# Altium schematic sheet C-02 LvDDR3.SchDoc
size 513 x 386 mm
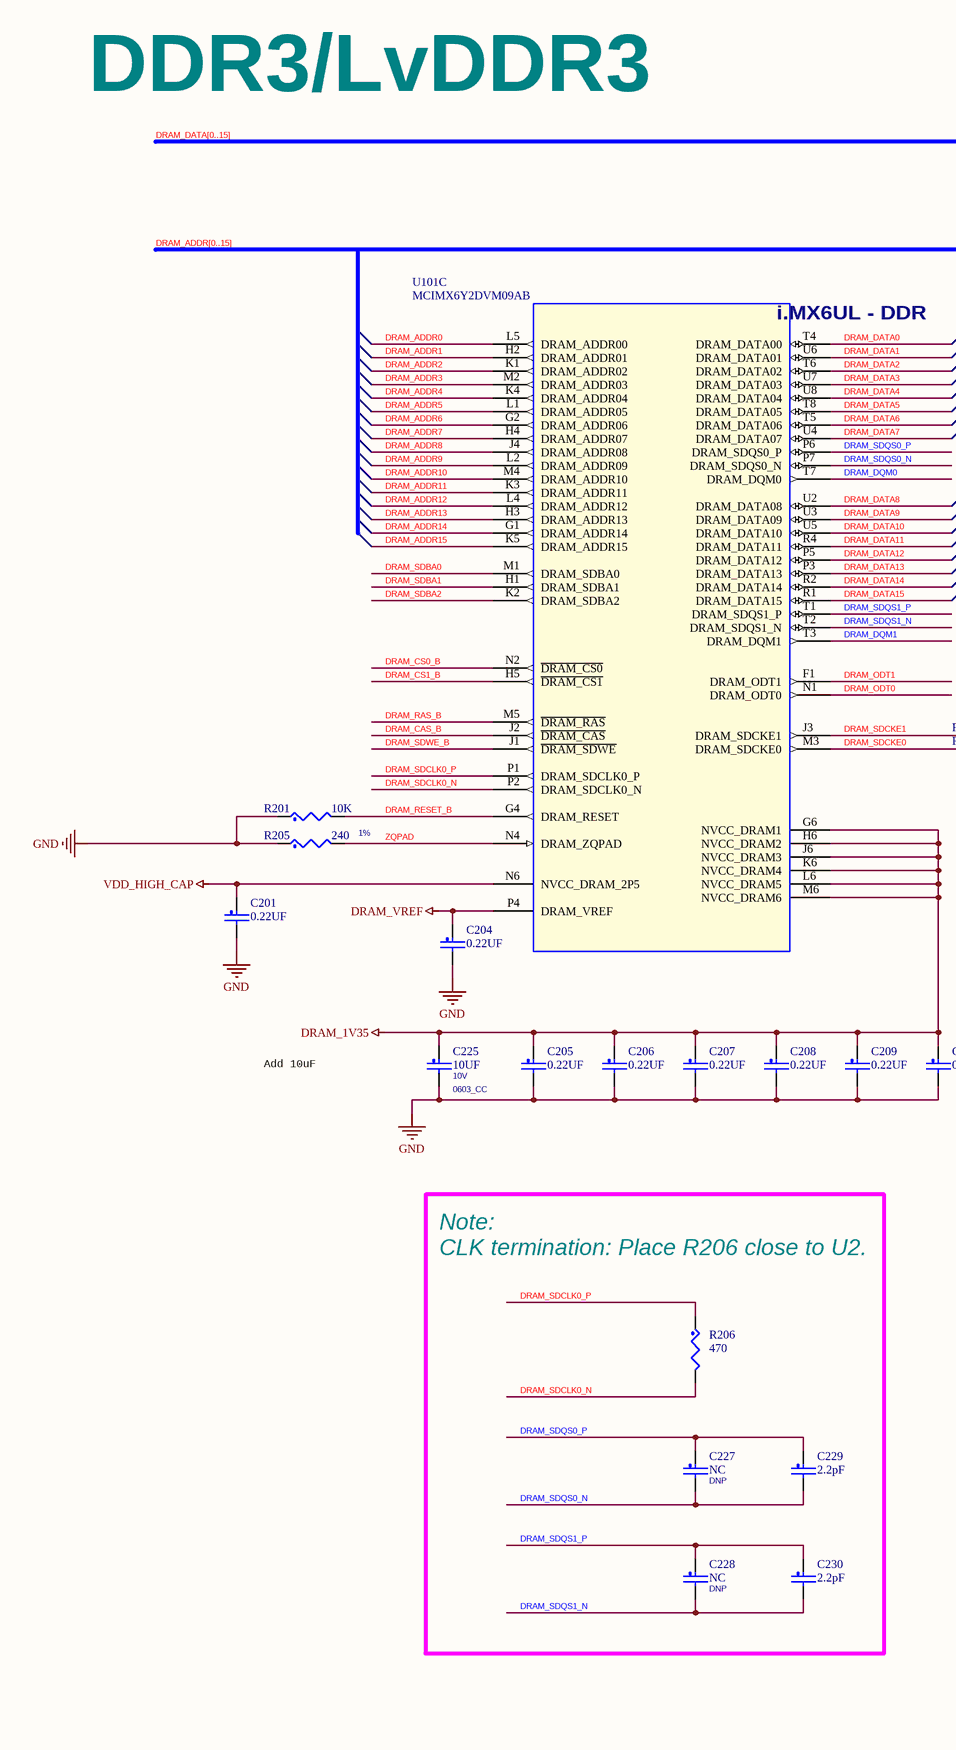
[diagram p0: C-02 LvDDR3.SchDoc, left]
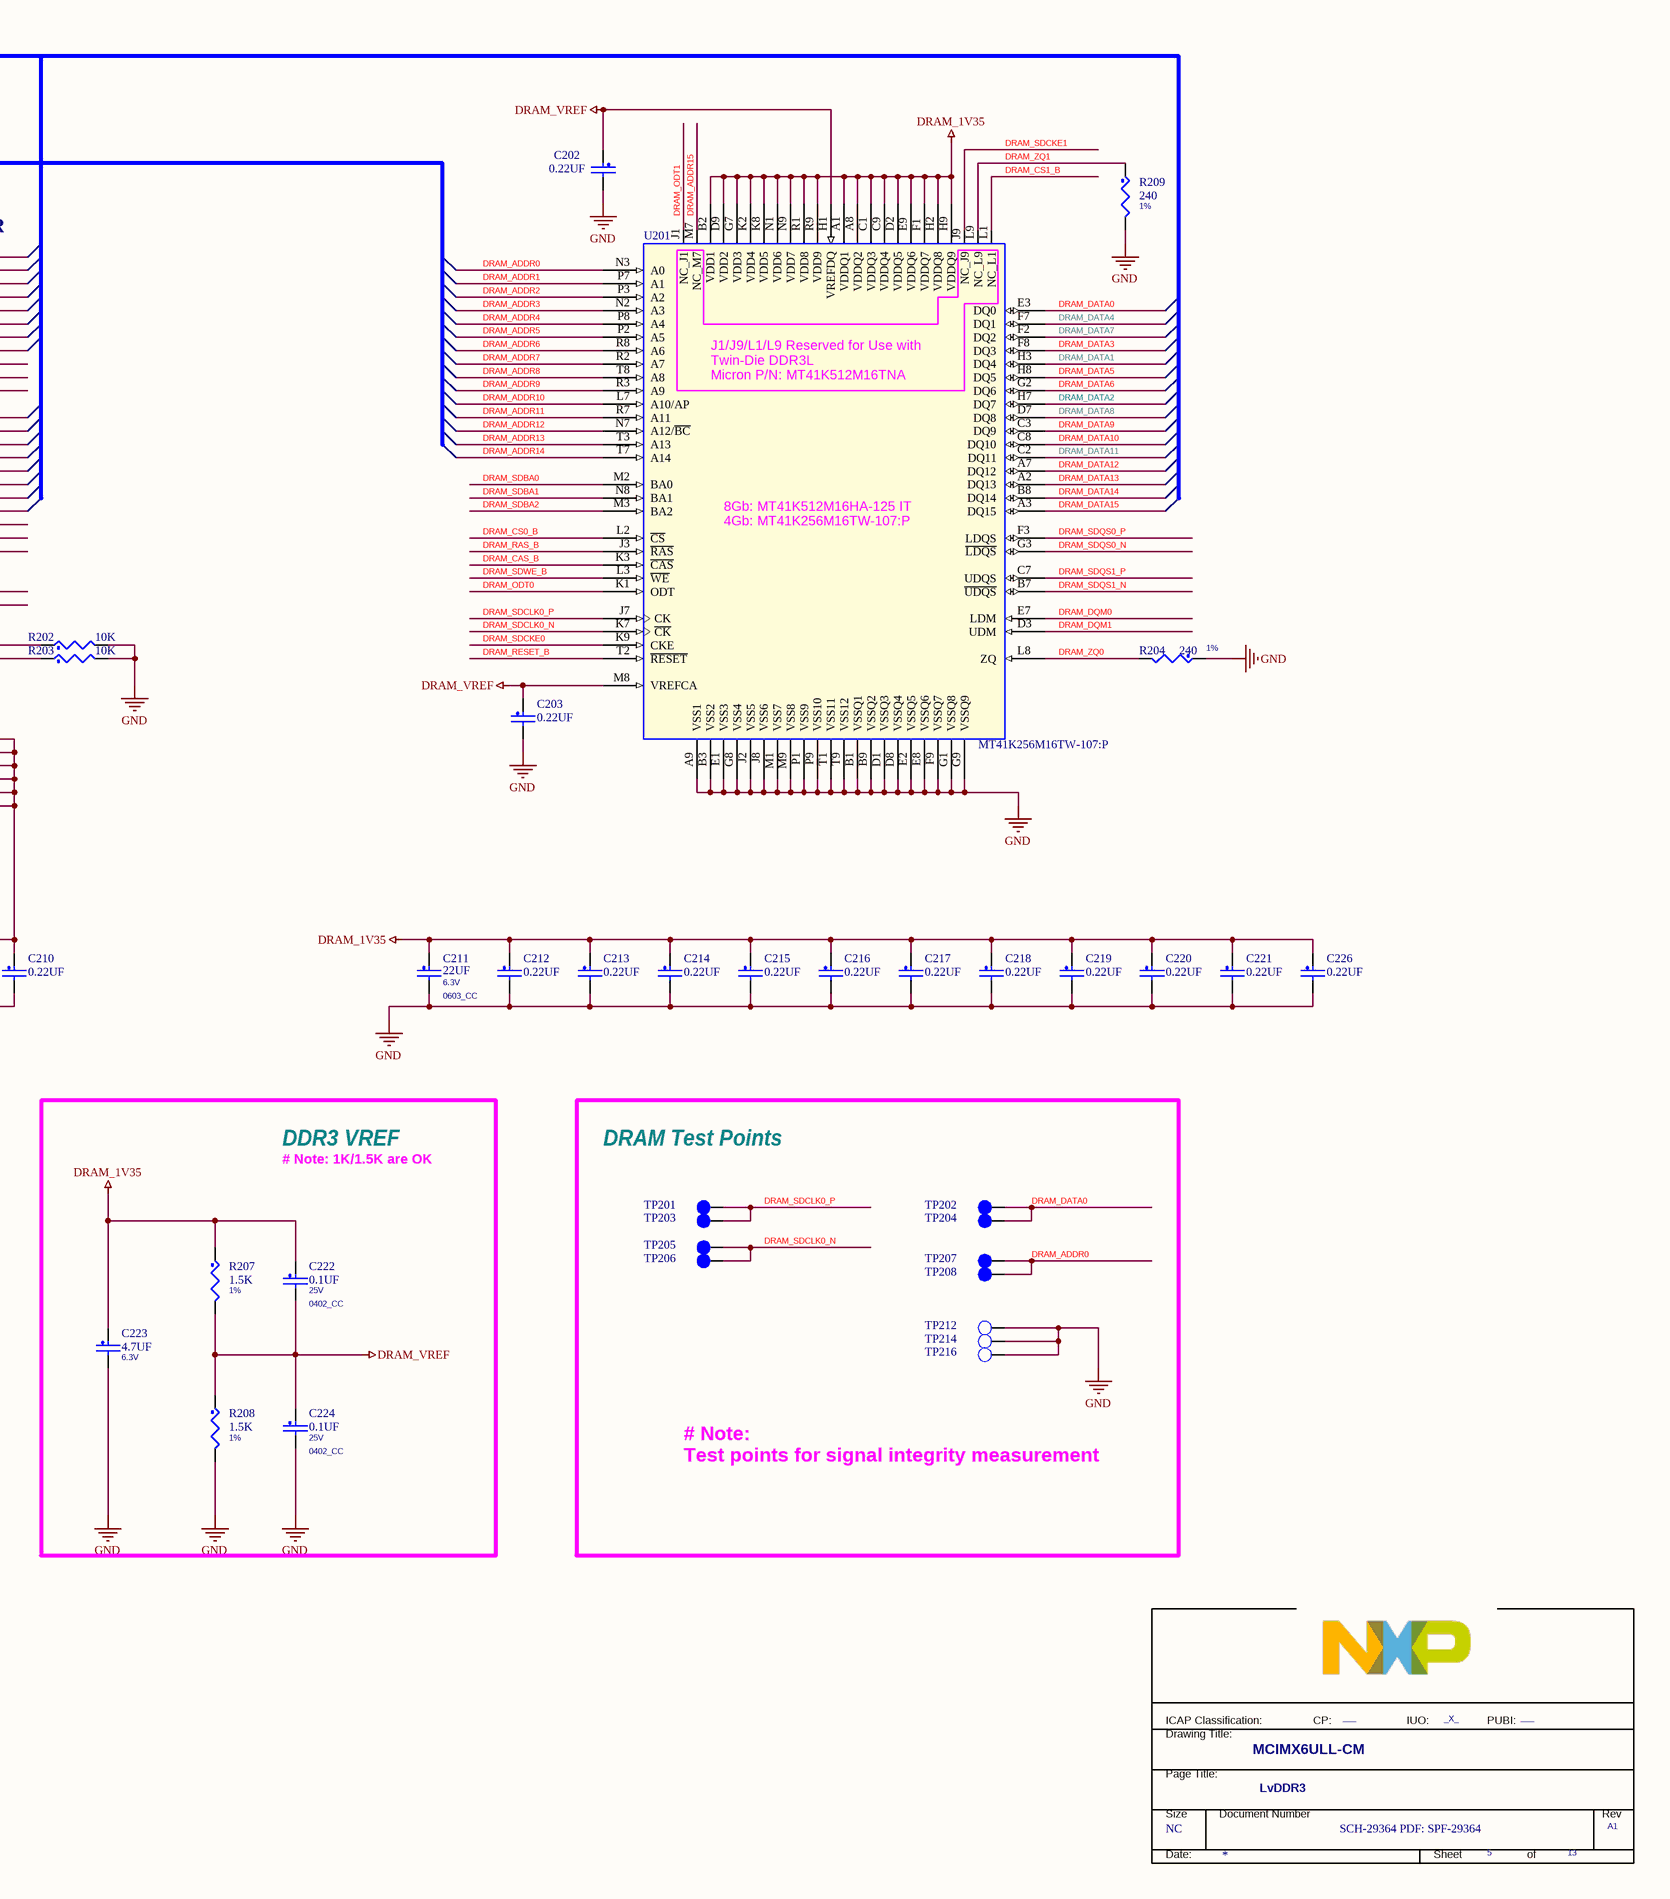
[diagram p1: C-02 LvDDR3.SchDoc, right]

## Parts
*  PageTitle: LvDDR3  Page Count: 13  Page Number: 5  Page Size: NC  Title: MCIMX6ULL-CM  RevCode: A1  Doc: SCH-29364 PDF: SPF-29364  FCP: ___  FIUO: _X_  (hidden comment: TitleBlock_FS)  (graphical)
C201  0.22UF  [0402T_C]
C202  0.22UF  [0402T_C]
C203  0.22UF  [0402T_C]
C204  0.22UF  [0402T_C]
C205  0.22UF  [0402T_C]
C206  0.22UF  [0402T_C]
C207  0.22UF  [0402T_C]
C208  0.22UF  [0402T_C]
C209  0.22UF  [0402T_C]
C210  0.22UF  [0402T_C]
C211  22UF  voltage rating: 6.3V  [0603_CC]
C212  0.22UF  [0402T_C]
C213  0.22UF  [0402T_C]
C214  0.22UF  [0402T_C]
C215  0.22UF  [0402T_C]
C216  0.22UF  [0402T_C]
C217  0.22UF  [0402T_C]
C218  0.22UF  [0402T_C]
C219  0.22UF  [0402T_C]
C220  0.22UF  [0402T_C]
C221  0.22UF  [0402T_C]
C222  0.1UF  VOLTAGE: 25V  PCB Footprint: 0402_CC  [0402T_C]
C223  4.7UF  voltage rating: 6.3V  [0402T_C]
C224  0.1UF  VOLTAGE: 25V  PCB Footprint: 0402_CC  [0402T_C]
C225  10UF  VOLTAGE: 10V  PCB Footprint: 0603_CC  [0402T_C]
C226  0.22UF  [0402T_C]
C227  NC  ASSY_OPT: DNP  [0402T_C]
C228  NC  ASSY_OPT: DNP  [0402T_C]
C229  2.2pF  [0402T_C]
C230  2.2pF  [0402T_C]
R201  10K  [0402T_C]
R202  10K  [0402T_C]
R203  10K  [0402T_C]
R204  240  Tolerance: 1%  [0402T_C]
R205  240  Tolerance: 1%  [0402T_C]
R206  470  [0402T_C]
R207  1.5K  Tolerance: 1%  [0402T_C]
R208  1.5K  Tolerance: 1%  [0402T_C]
R209  240  Tolerance: 1%  [0402T_C]
TP201  TPAD_015  [TPAD_015]  (value not drawn)
TP202  TPAD_015  [TPAD_015]  (value not drawn)
TP203  TPAD_015  [TPAD_015]  (value not drawn)
TP204  TPAD_015  [TPAD_015]  (value not drawn)
TP205  TPAD_015  [TPAD_015]  (value not drawn)
TP206  TPAD_015  [TPAD_015]  (value not drawn)
TP207  TPAD_015  [TPAD_015]  (value not drawn)
TP208  TPAD_015  [TPAD_015]  (value not drawn)
TP212  TP_35MIL  [testpoint_35mil]  (value not drawn)
TP214  TP_35MIL  [testpoint_35mil]  (value not drawn)
TP216  TP_35MIL  [testpoint_35mil]  (value not drawn)
U101  MCIMX6Y2DVM09AB  [BGA289_0P8_14X14]  (part C of 11)
U201  MT41K256M16TW-107:P  [bga96_0p8_8p15x14p15]

## Blocks framed on the sheet
DDR3 VREF: C222-C224 R207 R208
DRAM Test Points: TP201-TP208 TP212 TP214 TP216

## Nets
DRAM_1V35: C205.1 C206.1 C207.1 C208.1 C209.1 C210.1 C211.1 C212.1 C213.1 C214.1 C215.1 C216.1 C217.1 C218.1 C219.1 C220.1 C221.1 C222.1 C223.1 C225.1 C226.1 R207.1 U101.G6(NVCC_DRAM1) U101.H6(NVCC_DRAM2) U101.J6(NVCC_DRAM3) U101.K6(NVCC_DRAM4) U101.L6(NVCC_DRAM5) U101.M6(NVCC_DRAM6) U201.A1(VDDQ1) U201.A8(VDDQ2) U201.B2(VDD1) U201.C1(VDDQ3) U201.C9(VDDQ4) U201.D2(VDDQ5) U201.D9(VDD2) U201.E9(VDDQ6) U201.F1(VDDQ7) U201.G7(VDD3) U201.H2(VDDQ8) U201.H9(VDDQ9) U201.K2(VDD4) U201.K8(VDD5) U201.N1(VDD6) U201.N9(VDD7) U201.R1(VDD8) U201.R9(VDD9)
DRAM_VREF: C202.1 C203.1 C204.1 C222.2 C224.1 R207.2 R208.1 U101.P4(DRAM_VREF) U201.H1(VREFDQ) U201.M8(VREFCA)
GND: C201.2 C202.2 C203.2 C204.2 C205.2 C206.2 C207.2 C208.2 C209.2 C210.2 C211.2 C212.2 C213.2 C214.2 C215.2 C216.2 C217.2 C218.2 C219.2 C220.2 C221.2 C223.2 C224.2 C225.2 C226.2 R201.1 R202.2 R203.2 R204.1 R205.1 R208.2 R209.2 TP212.1(TP) TP214.1(TP) TP216.1(TP) U201.A9(VSS1) U201.B1(VSSQ1) U201.B3(VSS2) U201.B9(VSSQ2) U201.D1(VSSQ3) U201.D8(VSSQ4) U201.E1(VSS3) U201.E2(VSSQ5) U201.E8(VSSQ6) U201.F9(VSSQ7) U201.G1(VSSQ8) U201.G8(VSS4) U201.G9(VSSQ9) U201.J2(VSS5) U201.J8(VSS6) U201.M1(VSS7) U201.M9(VSS8) U201.P1(VSS9) U201.P9(VSS10) U201.T1(VSS11) U201.T9(VSS12)
VDD_HIGH_CAP: C201.1 U101.N6(NVCC_DRAM_2P5)
DRAM_ADDR0: TP207.1(Pin1) TP208.1(Pin1) U101.L5(DRAM_ADDR00) U201.N3(A0)
DRAM_ADDR1: U101.H2(DRAM_ADDR01) U201.P7(A1)
DRAM_ADDR2: U101.K1(DRAM_ADDR02) U201.P3(A2)
DRAM_ADDR3: U101.M2(DRAM_ADDR03) U201.N2(A3)
DRAM_ADDR4: U101.K4(DRAM_ADDR04) U201.P8(A4)
DRAM_ADDR5: U101.L1(DRAM_ADDR05) U201.P2(A5)
DRAM_ADDR6: U101.G2(DRAM_ADDR06) U201.R8(A6)
DRAM_ADDR7: U101.H4(DRAM_ADDR07) U201.R2(A7)
DRAM_ADDR8: U101.J4(DRAM_ADDR08) U201.T8(A8)
DRAM_ADDR9: U101.L2(DRAM_ADDR09) U201.R3(A9)
DRAM_ADDR10: U101.M4(DRAM_ADDR10) U201.L7(A10/AP)
DRAM_ADDR11: U101.K3(DRAM_ADDR11) U201.R7(A11)
DRAM_ADDR12: U101.L4(DRAM_ADDR12) U201.N7(A12/~{BC})
DRAM_ADDR13: U101.H3(DRAM_ADDR13) U201.T3(A13)
DRAM_ADDR14: U101.G1(DRAM_ADDR14) U201.T7(A14)
DRAM_ADDR15: U101.K5(DRAM_ADDR15) U201.M7(NC_M7)
DRAM_CAS_B: U101.J2(~{DRAM_CAS}) U201.K3(~{CAS})
DRAM_CS0_B: U101.N2(~{DRAM_CS0}) U201.L2(~{CS})
DRAM_CS1_B: U101.H5(~{DRAM_CS1}) U201.L1(NC_L1)
DRAM_DATA0: TP202.1(Pin1) TP204.1(Pin1) U101.T4(DRAM_DATA00) U201.E3(DQ0)
DRAM_DATA1: U101.U6(DRAM_DATA01) U201.H3(DQ4)
DRAM_DATA2: U101.T6(DRAM_DATA02) U201.H7(DQ7)
DRAM_DATA3: U101.U7(DRAM_DATA03) U201.F8(DQ3)
DRAM_DATA4: U101.U8(DRAM_DATA04) U201.F7(DQ1)
DRAM_DATA5: U101.T8(DRAM_DATA05) U201.H8(DQ5)
DRAM_DATA6: U101.T5(DRAM_DATA06) U201.G2(DQ6)
DRAM_DATA7: U101.U4(DRAM_DATA07) U201.F2(DQ2)
DRAM_DATA8: U101.U2(DRAM_DATA08) U201.D7(DQ8)
DRAM_DATA9: U101.U3(DRAM_DATA09) U201.C3(DQ9)
DRAM_DATA10: U101.U5(DRAM_DATA10) U201.C8(DQ10)
DRAM_DATA11: U101.R4(DRAM_DATA11) U201.C2(DQ11)
DRAM_DATA12: U101.P5(DRAM_DATA12) U201.A7(DQ12)
DRAM_DATA13: U101.P3(DRAM_DATA13) U201.A2(DQ13)
DRAM_DATA14: U101.R2(DRAM_DATA14) U201.B8(DQ14)
DRAM_DATA15: U101.R1(DRAM_DATA15) U201.A3(DQ15)
DRAM_DQM0: U101.T7(DRAM_DQM0) U201.E7(LDM)
DRAM_DQM1: U101.T3(DRAM_DQM1) U201.D3(UDM)
DRAM_ODT0: U101.N1(DRAM_ODT0) U201.K1(ODT)
DRAM_ODT1: U101.F1(DRAM_ODT1) U201.J1(NC_J1)
DRAM_RAS_B: U101.M5(~{DRAM_RAS}) U201.J3(~{RAS})
DRAM_RESET_B: R201.2 U101.G4(DRAM_RESET) U201.T2(~{RESET})
DRAM_SDBA0: U101.M1(DRAM_SDBA0) U201.M2(BA0)
DRAM_SDBA1: U101.H1(DRAM_SDBA1) U201.N8(BA1)
DRAM_SDBA2: U101.K2(DRAM_SDBA2) U201.M3(BA2)
DRAM_SDCKE0: R203.1 U101.M3(DRAM_SDCKE0) U201.K9(CKE)
DRAM_SDCKE1: R202.1 U101.J3(DRAM_SDCKE1) U201.J9(NC_J9)
DRAM_SDCLK0_N: R206.2 TP205.1(Pin1) TP206.1(Pin1) U101.P2(DRAM_SDCLK0_N) U201.K7(~{CK})
DRAM_SDCLK0_P: R206.1 TP201.1(Pin1) TP203.1(Pin1) U101.P1(DRAM_SDCLK0_P) U201.J7(CK)
DRAM_SDQS0_N: C227.2 C229.2 U101.P7(DRAM_SDQS0_N) U201.G3(~{LDQS})
DRAM_SDQS0_P: C227.1 C229.1 U101.P6(DRAM_SDQS0_P) U201.F3(LDQS)
DRAM_SDQS1_N: C228.2 C230.2 U101.T2(DRAM_SDQS1_N) U201.B7(~{UDQS})
DRAM_SDQS1_P: C228.1 C230.1 U101.T1(DRAM_SDQS1_P) U201.C7(UDQS)
DRAM_SDWE_B: U101.J1(~{DRAM_SDWE}) U201.L3(~{WE})
DRAM_ZQ0: R204.2 U201.L8(ZQ)
DRAM_ZQ1: R209.1 U201.L9(NC_L9)
ZQPAD: R205.2 U101.N4(DRAM_ZQPAD)

## Buses and harness runs
bus DRAM_ADDR[0..15]
bus DRAM_DATA[0..15]

## Notes on the sheet
- DDR3/LvDDR3
- (near U201) J1/J9/L1/L9 Reserved for Use with
  Twin-Die DDR3L
  Micron P/N: MT41K512M16TNA
- (near U201) 8Gb: MT41K512M16HA-125 IT
  4Gb: MT41K256M16TW-107:P
- Add 10uF
- Note:
  CLK termination: Place R206 close to U2.
- # Note: 1K/1.5K are OK
- # Note:
  Test points for signal integrity measurement
- (in symbol MCIMX6Y2DVM05AA_PBGA_289P, part C) i.MX6UL - DDR
- (in symbol TitleBlock_FS) ICAP Classification:; CP:; IUO:; PUBI:; Drawing Title:; Page Title:; Size; Document Number; Rev; Date:; Sheet; of

## Library data of the parts
* = TitleBlock_FS: OrgName: Freescale Semiconductor; OrgAddr1: 6501 William Cannon Drive West; OrgAddr2: Austin, TX 78735-8598; Page Create Date: March  8, 1995; PUBI: ___; Page Modify Date: *
C201 C205-C209 C212-C216 C226 = CAP_NP: CAP CER 0.22UF 10V 10% X5R 0402; CLASS: DISCRETE; PCB Footprint: 0402_CC; FPLIST: CC0402_25,CC0402_HD,0402_CC; CAD_APPROVED: Yes; MFG_PN01: NMC0402X5R224K10TRPF; MFG_NAME01: NIC COMPONENTS CORP; AGILE_PN: 150-77358; VOLTAGE: 10V; HEIGHT: 0.55MM; ROHS: Yes; Tolerance: 10%
C202-C204 C210 C217-C221 = CAP_NP: CAP CER 0.22UF 10V 10% X5R 0402; CLASS: DISCRETE; PCB Footprint: 0402_CC; AGILE_PN: 150-77358; MFG_NAME01: NIC COMPONENTS CORP; MFG_PN01: NMC0402X5R224K10TRPF; CAD_APPROVED: Yes; FPLIST: CC0402_25,CC0402_HD,0402_CC; Tolerance: 10%; ROHS: Yes; HEIGHT: 0.55MM; VOLTAGE: 10V
C211 = CAP_NP: CAP CER 22UF 6.3V 20% X5R 0603; CLASS: DISCRETE; AGILE_PN: 150-78467; MFG_NAME01: Samsung; MFG_PN01: CL10A226MQ8NRNE; CAD_APPROVED: Yes; FPLIST: CC0603_OV,CC0603,0603_CC; Tolerance: 20%; ROHS: Yes; HEIGHT: 1MM; VOLTAGE: 6.3V; PCB Footprint: 0603_CC
C222 C224 = CAP_NP: CAP CER 0.1UF 25V 10% X5R 0402; CLASS: DISCRETE; AGILE_PN: 150-78633; MFG_NAME01: YAGEO AMERICA; MFG_PN01: CC0402KRX5R8BB104; CAD_APPROVED: Yes; FPLIST: CC0402_25,CC0402_HD,0402_CC; Tolerance: 10%; ROHS: Yes; HEIGHT: 0.55MM
C223 = CAP_NP: CAP CER 4.7UF 6.3V 20% X5R 0402; CLASS: DISCRETE; FPLIST: CC0402_25,CC0402_HD,0402_CC; CAD_APPROVED: Yes; MFG_PN01: C1005X5R0J475M050BC; MFG_NAME01: TDK; AGILE_PN: 150-78463; PCB Footprint: 0402_CC; HEIGHT: 0.65MM; ROHS: Yes; Tolerance: 20%; VOLTAGE: 6.3V
C225 = CAP_NP: CAP CER 10UF 10V 20% X5R 0603; CLASS: DISCRETE; FPLIST: CC0603_OV,CC0603,0603_CC; CAD_APPROVED: Yes; MFG_PN01: LMK107BJ106MALTD; MFG_NAME01: TAIYO YUDEN; AGILE_PN: 150-78609; HEIGHT: 1.016MM; ROHS: Yes
C227-C230 = CAP_NP: CAP CER 2.2pF 50V 0.25pF C0G 0402; CLASS: DISCRETE; FPLIST: CC0402_25,CC0402_HD,0402_CC; CAD_APPROVED: Yes; MFG_PN01: GRM1555C1H2R2CA01D; MFG_NAME01: MURATA; Tolerance: 11.36%; AGILE_PN: 150-79743; PCB Footprint: 0402_CC; VOLTAGE: 50V; HEIGHT: 0.55MM; ROHS: Yes
R201-R203 = RES: RES MF 10K 1/16W 5% 0402; CLASS: DISCRETE; FPLIST: RC0402_25,RC0402_HD,0402_CC; CAD_APPROVED: Yes; MFG_PN01: CRCW040210K0JNED; MFG_NAME01: VISHAY INTERTECHNOLOGY; AGILE_PN: 470-75557; PCB Footprint: 0402_CC; HEIGHT: 0.4 MM; ROHS: Yes; Tolerance: 5%
R204 R209 = RES: RES MF 240 OHM 1/16W 1% 0402; CLASS: DISCRETE; AGILE_PN: 470-30776; MFG_NAME01: WALSIN TECHNOLOGY CORP.; MFG_PN01: WR04X2400FTL; CAD_APPROVED: Yes; FPLIST: RC0402_25,RC0402_HD,0402_CC; PCB Footprint: 0402_CC; HEIGHT: 0.40 MM; ROHS: Yes
R205 = RES: RES MF 240 OHM 1/16W 1% 0402; CLASS: DISCRETE; FPLIST: RC0402_25,RC0402_HD,0402_CC; CAD_APPROVED: Yes; MFG_PN01: WR04X2400FTL; MFG_NAME01: WALSIN TECHNOLOGY CORP.; AGILE_PN: 470-30776; PCB Footprint: 0402_CC; HEIGHT: 0.40 MM; ROHS: Yes
R206 = RES: RES MF 470 OHM 1/16W 5% 0402; CLASS: DISCRETE; AGILE_PN: 470-30315; MFG_NAME01: SMEC; MFG_PN01: RC73L2Z471JTF; CAD_APPROVED: Yes; FPLIST: RC0402_25,RC0402_HD,0402_CC; PCB Footprint: 0402_CC; HEIGHT: 0.45mm; Tolerance: 5%; ROHS: Yes
R207 R208 = RES: RES MF 1.5K 1/16W 1% 0402; CLASS: DISCRETE; AGILE_PN: 470-80487; MFG_NAME01: BOURNS; MFG_PN01: CR0402-FX-1501GLF; CAD_APPROVED: Yes; FPLIST: RC0402_25,RC0402_HD,0402_CC; PCB Footprint: 0402_CC; HEIGHT: 0.4MM; ROHS: Yes
TP201 TP203 = TESTLOOP: TEST POINT PAD 15MIL DIA SMT, NO PART TO ORDER; CLASS: IO; CAD_APPROVED: Yes; MFG_PN01: NOTACOMPONENT; AGILE_PN: 211-76645; HEIGHT: 0.1MM; ROHS: Yes; MFG_NAME01: NOTACOMPONENT; PCB Footprint: TPAD_015
TP202 TP204-TP208 = TESTLOOP: TEST POINT PAD 15MIL DIA SMT, NO PART TO ORDER; CLASS: IO; AGILE_PN: 211-76645; MFG_NAME01: NOTACOMPONENT; CAD_APPROVED: Yes; MFG_PN01: NOTACOMPONENT; ROHS: Yes; HEIGHT: 0.1MM; PCB Footprint: TPAD_015
TP212 = T POINT R: TEST POINT PAD .035 SMT, no part to order; CLASS: IC; CAD_APPROVED: Yes; AGILE_PN: 510-75618; HEIGHT: 0.1MM; ROHS: Yes; PCB Footprint: testpoint_35mil
TP214 TP216 = T POINT R: TEST POINT PAD .035 SMT, no part to order; CLASS: IC; AGILE_PN: 510-75618; CAD_APPROVED: Yes; ROHS: Yes; HEIGHT: 0.1MM; PCB Footprint: testpoint_35mil
U101 = MCIMX6Y2DVM05AA_PBGA_289P: IC CPU ARM COREA7 900MHZ 16BIT 3-3.6V PBGA289; CAD_APPROVED: Yes; PRE_APN: 330-77080; Temp_Range: 0C to +95C; MFG_NAME01: NXP SEMICONDUCTORS; AGILE_PN: TMP-WF-33487; CLASS: IC; HEIGHT: 1.32MM; ROHS: Yes; MFG_PN01: MCIMX6Y2DVM09AB; PCB Footprint: BGA289_0P8_14X14
U201 = MT41J256M16RE_FBGA96: IC MEM DDR3 SDRAM 256MX16 1.071NS 1.35V FBGA96; CAD_APPROVED: Yes; MFG_NAME01: MICRON; AGILE_PN: 334-77510; CLASS: IC; HEIGHT: 1.2 MM; ROHS: Yes; MFG_PN01: MT41K256M16TW-107:P; PCB Footprint: bga96_0p8_8p15x14p15